# EAGLE design EnsembleFour (EAGLE 7.6.0)
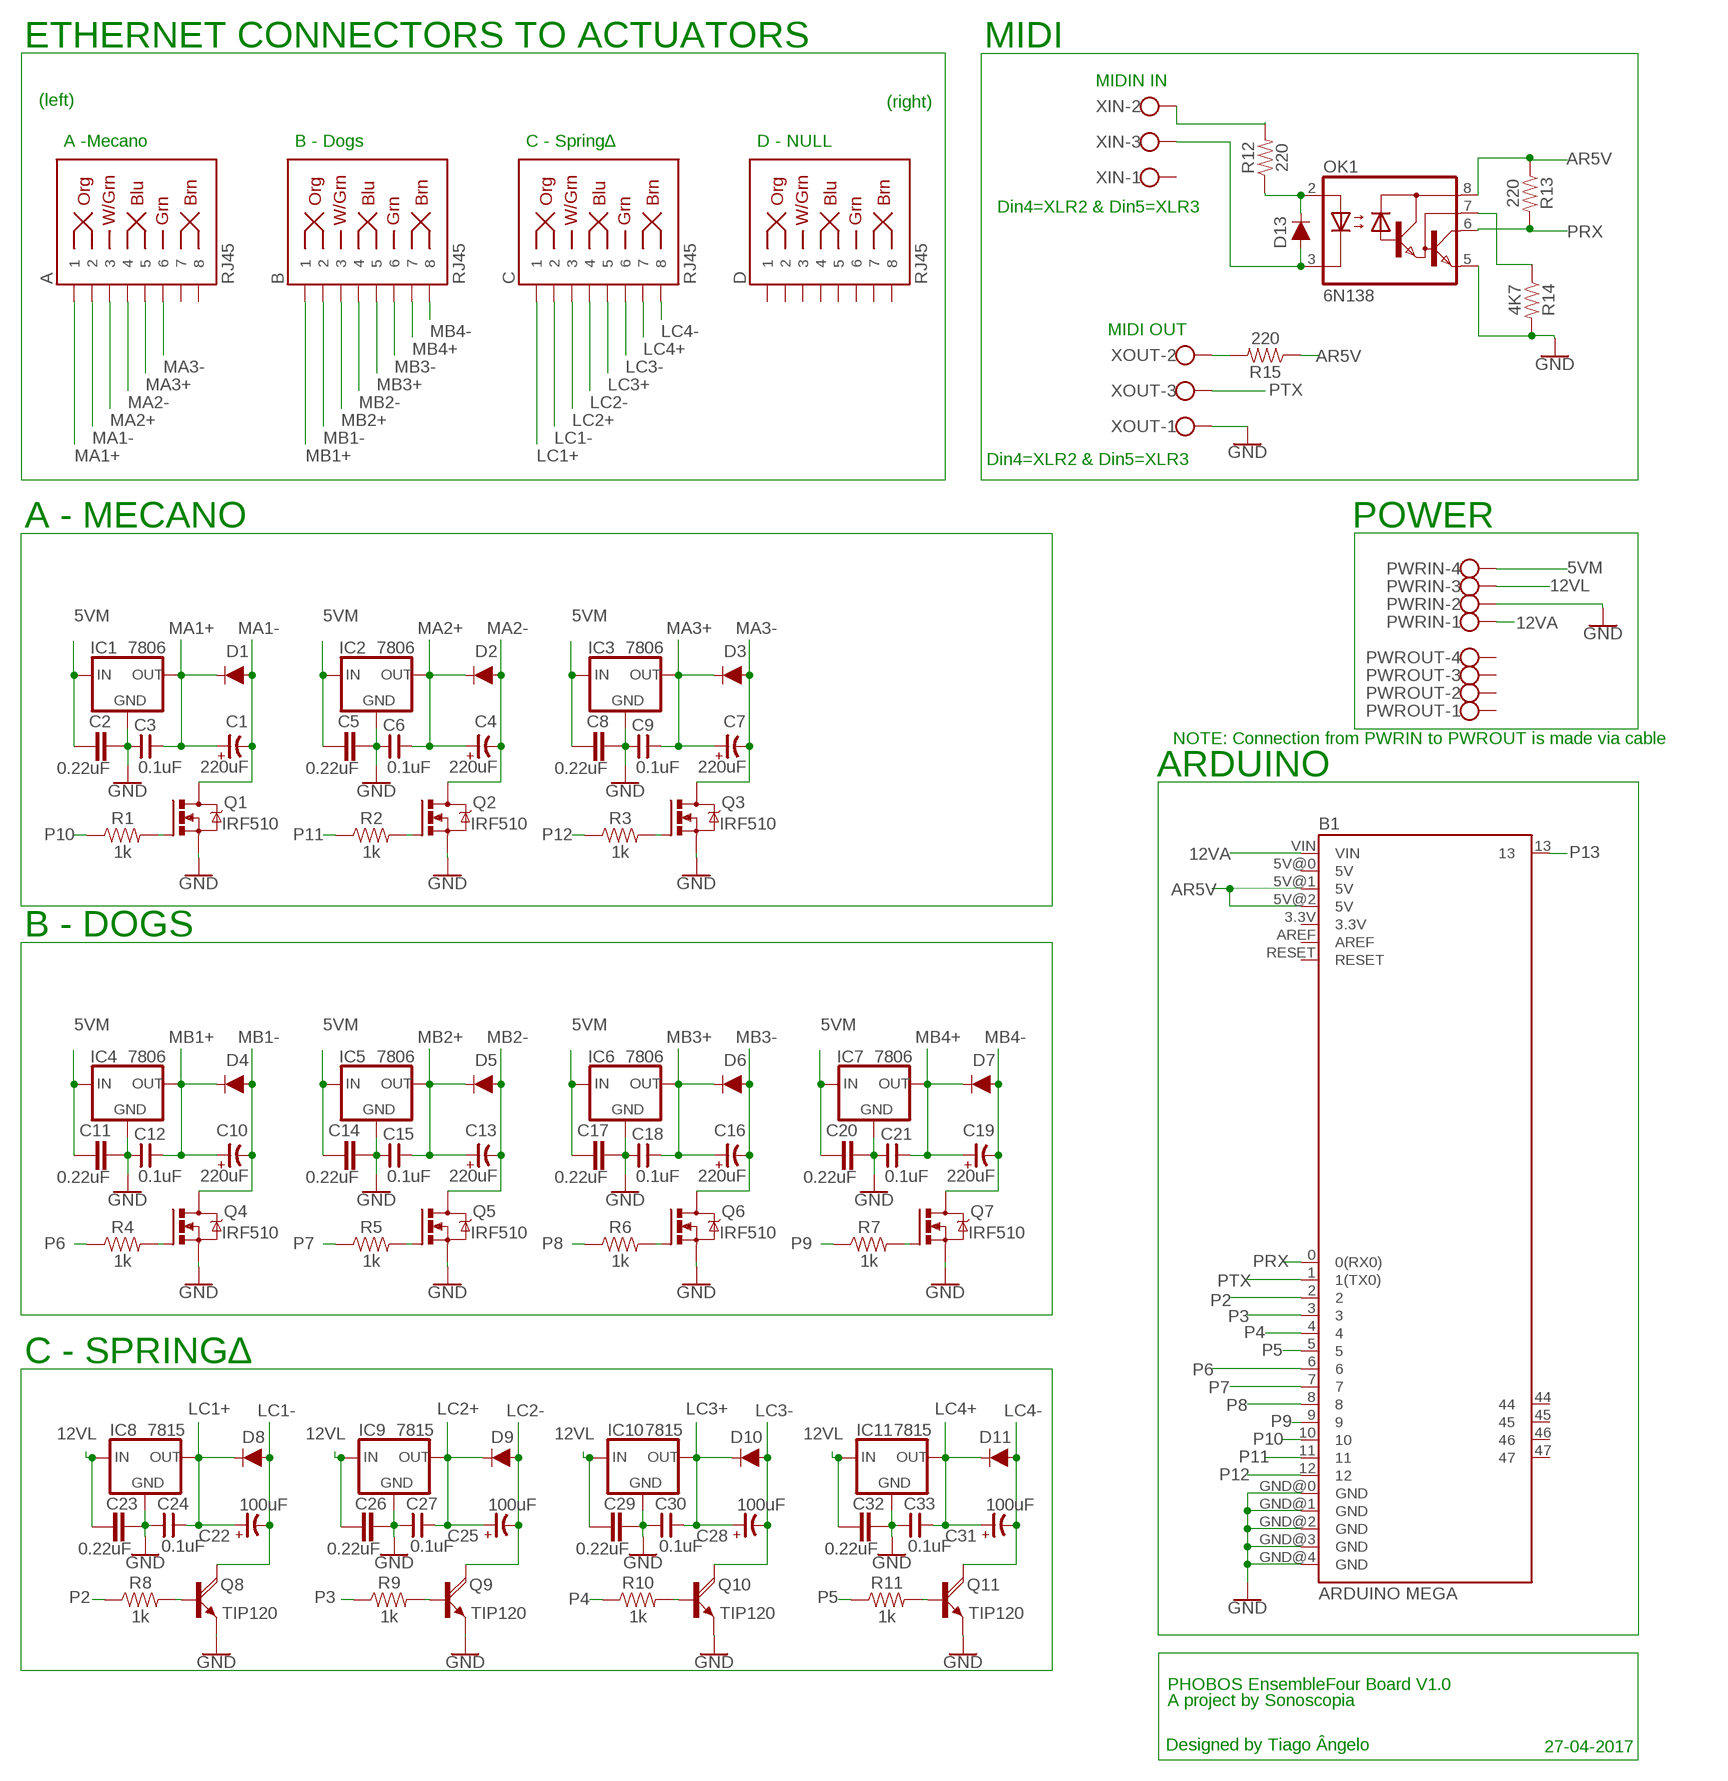
[diagram p0: schematic, sheet 1]

## Parts
A  RJ45  RJ45-8  [RJ45-8]
B  RJ45  RJ45-8  [RJ45-8]
B1  ARDUINO MEGA  ARDUINO_MEGA_R3FULL  [ARDUINO_MEGA]
C  RJ45  RJ45-8  [RJ45-8]
C1  220uF  CP-E-035X080  [E-035X080]
C2  0.22uF  C5/3  [C5B3]
C3  0.1uF  CNP-C025-050X025  [C025-050X025]
C4  220uF  CP-E-035X080  [E-035X080]
C5  0.22uF  C5/3  [C5B3]
C6  0.1uF  CNP-C025-050X025  [C025-050X025]
C7  220uF  CP-E-035X080  [E-035X080]
C8  0.22uF  C5/3  [C5B3]
C9  0.1uF  CNP-C025-050X025  [C025-050X025]
C10  220uF  CP-E-035X080  [E-035X080]
C11  0.22uF  C5/3  [C5B3]
C12  0.1uF  CNP-C025-050X025  [C025-050X025]
C13  220uF  CP-E-035X080  [E-035X080]
C14  0.22uF  C5/3  [C5B3]
C15  0.1uF  CNP-C025-050X025  [C025-050X025]
C16  220uF  CP-E-035X080  [E-035X080]
C17  0.22uF  C5/3  [C5B3]
C18  0.1uF  CNP-C025-050X025  [C025-050X025]
C19  220uF  CP-E-035X080  [E-035X080]
C20  0.22uF  C5/3  [C5B3]
C21  0.1uF  CNP-C025-050X025  [C025-050X025]
C22  100uF  CP-E-020X050  [E-020X050]
C23  0.22uF  C5/3  [C5B3]
C24  0.1uF  CNP-C025-050X025  [C025-050X025]
C25  100uF  CP-E-020X050  [E-020X050]
C26  0.22uF  C5/3  [C5B3]
C27  0.1uF  CNP-C025-050X025  [C025-050X025]
C28  100uF  CP-E-020X050  [E-020X050]
C29  0.22uF  C5/3  [C5B3]
C30  0.1uF  CNP-C025-050X025  [C025-050X025]
C31  100uF  CP-E-020X050  [E-020X050]
C32  0.22uF  C5/3  [C5B3]
C33  0.1uF  CNP-C025-050X025  [C025-050X025]
D  RJ45  RJ45-8  [RJ45-8]
D1  1A/50V/1.1V  DIODE-KIT2  [DIODE-1N4001-KIT]
D2  1A/50V/1.1V  DIODE-KIT2  [DIODE-1N4001-KIT]
D3  1A/50V/1.1V  DIODE-KIT2  [DIODE-1N4001-KIT]
D4  1A/50V/1.1V  DIODE-KIT2  [DIODE-1N4001-KIT]
D5  1A/50V/1.1V  DIODE-KIT2  [DIODE-1N4001-KIT]
D6  1A/50V/1.1V  DIODE-KIT2  [DIODE-1N4001-KIT]
D7  1A/50V/1.1V  DIODE-KIT2  [DIODE-1N4001-KIT]
D8  1A/50V/1.1V  DIODE-KIT2  [DIODE-1N4001-KIT]
D9  1A/50V/1.1V  DIODE-KIT2  [DIODE-1N4001-KIT]
D10  1A/50V/1.1V  DIODE-KIT2  [DIODE-1N4001-KIT]
D11  1A/50V/1.1V  DIODE-KIT2  [DIODE-1N4001-KIT]
D13  200mA/100V/1V  DIODE-1N4148  [DIODE-1N4148]
IC1  7806  78XXS  [78XXS]
IC2  7806  78XXS  [78XXS]
IC3  7806  78XXS  [78XXS]
IC4  7806  78XXS  [78XXS]
IC5  7806  78XXS  [78XXS]
IC6  7806  78XXS  [78XXS]
IC7  7806  78XXS  [78XXS]
IC8  7815  78XXS  [78XXS]
IC9  7815  78XXS  [78XXS]
IC10  7815  78XXS  [78XXS]
IC11  7815  78XXS  [78XXS]
OK1  6N138  [DIL08]
PWRIN  W237-4  [W237-4]
PWROUT  W237-4  [W237-4]
Q1  IRF510  IRF520  [TO220BV]
Q2  IRF510  IRF520  [TO220BV]
Q3  IRF510  IRF520  [TO220BV]
Q4  IRF510  IRF520  [TO220BV]
Q5  IRF510  IRF520  [TO220BV]
Q6  IRF510  IRF520  [TO220BV]
Q7  IRF510  IRF520  [TO220BV]
Q8  TIP120  TIP120V  [TO220AV]
Q9  TIP120  TIP120V  [TO220AV]
Q10  TIP120  TIP120V  [TO220AV]
Q11  TIP120  TIP120V  [TO220AV]
R1  1k  1KOHM-VERT-1/4W-1%  [AXIAL-0.1]
R2  1k  1KOHM-VERT-1/4W-1%  [AXIAL-0.1]
R3  1k  1KOHM-VERT-1/4W-1%  [AXIAL-0.1]
R4  1k  1KOHM-VERT-1/4W-1%  [AXIAL-0.1]
R5  1k  1KOHM-VERT-1/4W-1%  [AXIAL-0.1]
R6  1k  1KOHM-VERT-1/4W-1%  [AXIAL-0.1]
R7  1k  1KOHM-VERT-1/4W-1%  [AXIAL-0.1]
R8  1k  1KOHM-VERT-1/4W-1%  [AXIAL-0.1]
R9  1k  1KOHM-VERT-1/4W-1%  [AXIAL-0.1]
R10  1k  1KOHM-VERT-1/4W-1%  [AXIAL-0.1]
R11  1k  1KOHM-VERT-1/4W-1%  [AXIAL-0.1]
R12  220  1KOHM-HORIZ-1/4W-5%  [AXIAL-0.3]
R13  220  1KOHM-HORIZ-1/4W-5%  [AXIAL-0.3]
R14  4K7  1KOHM-HORIZ-1/4W-5%  [AXIAL-0.3]
R15  220  1KOHM-HORIZ-1/4W-5%  [AXIAL-0.3]
XIN  W237-103  [W237-103]
XOUT  W237-103  [W237-103]

## Nets
5VM [5VM]: C2.1 C5.1 C8.1 C11.1 C14.1 C17.1 C20.1 IC1.IN IC2.IN IC3.IN IC4.IN IC5.IN IC6.IN IC7.IN PWRIN.4
12VA [12VA]: B1.VIN PWRIN.1
12VL [12VL]: C23.1 C26.1 C29.1 C32.1 IC8.IN IC9.IN IC10.IN IC11.IN PWRIN.3
AR5V: B1.5V@1(5V) B1.5V@2(5V) OK1.8(VCC) R13.P$1 R15.P$1
GND [GND]: B1.GND@0(GND) B1.GND@1(GND) B1.GND@2(GND) B1.GND@3(GND) B1.GND@4(GND) C2.2 C3.1 C5.2 C6.1 C8.2 C9.1 C11.2 C12.1 C14.2 C15.1 C17.2 C18.1 C20.2 C21.1 C23.2 C24.1 C26.2 C27.1 C29.2 C30.1 C32.2 C33.1 IC1.GND IC2.GND IC3.GND IC4.GND IC5.GND IC6.GND IC7.GND IC8.GND IC9.GND IC10.GND IC11.GND OK1.5(GND) PWRIN.2 Q1.S Q2.S Q3.S Q4.S Q5.S Q6.S Q7.S Q8.E Q9.E Q10.E Q11.E R14.P$2 XOUT.1
LC1+: C22.+ C24.2 C.1 D8.C IC8.OUT
LC1-: C22.- C.2 D8.A Q8.C
LC2+: C25.+ C27.2 C.3 D9.C IC9.OUT
LC2-: C25.- C.4 D9.A Q9.C
LC3+: C28.+ C30.2 C.5 D10.C IC10.OUT
LC3-: C28.- C.6 D10.A Q10.C
LC4+: C31.+ C33.2 C.7 D11.C IC11.OUT
LC4-: C31.- C.8 D11.A Q11.C
MA1+: A.1 C1.+ C3.2 D1.C IC1.OUT
MA1-: A.2 C1.- D1.A Q1.D
MA2+: A.3 C4.+ C6.2 D2.C IC2.OUT
MA2-: A.4 C4.- D2.A Q2.D
MA3+: A.5 C7.+ C9.2 D3.C IC3.OUT
MA3-: A.6 C7.- D3.A Q3.D
MB1+: B.1 C10.+ C12.2 D4.C IC4.OUT
MB1-: B.2 C10.- D4.A Q4.D
MB2+: B.3 C13.+ C15.2 D5.C IC5.OUT
MB2-: B.4 C13.- D5.A Q5.D
MB3+: B.5 C16.+ C18.2 D6.C IC6.OUT
MB3-: B.6 C16.- D6.A Q6.D
MB4+: B.7 C19.+ C21.2 D7.C IC7.OUT
MB4-: B.8 C19.- D7.A Q7.D
N$1: Q1.G R1.P$2
N$2: R15.P$2 XOUT.2
N$3: Q2.G R2.P$2
N$4: Q9.B R9.P$2
N$5: Q10.B R10.P$2
N$9: Q8.B R8.P$2
N$14: Q3.G R3.P$2
N$16: Q4.G R4.P$2
N$18: Q5.G R5.P$2
N$19: Q6.G R6.P$2
N$20: Q7.G R7.P$2
N$21: Q11.B R11.P$2
N$25: D13.A OK1.3(C) XIN.3
N$26: D13.C OK1.2(A) R12.P$1
N$27: R12.P$2 XIN.2
N$29: OK1.7(VB) R14.P$1
P2: B1.2 R8.P$1
P3: B1.3 R9.P$1
P4: B1.4 R10.P$1
P5: B1.5 R11.P$1
P6: B1.6 R4.P$1
P7: B1.7 R5.P$1
P8: B1.8 R6.P$1
P9: B1.9 R7.P$1
P10: B1.10 R1.P$1
P11: B1.11 R2.P$1
P12: B1.12 R3.P$1
P13: B1.13
PRX: B1.0(0(RX0)) OK1.6(VO) R13.P$2
PTX: B1.1(1(TX0)) XOUT.3
Unconnected: A.7 A.8 B1.3.3V B1.5V@0(5V) B1.44 B1.45 B1.46 B1.47 B1.AREF B1.RESET D.1 D.2 D.3 D.4 D.5 D.6 D.7 D.8 PWROUT.1 PWROUT.2 PWROUT.3 PWROUT.4 XIN.1

## Notes on the sheet
- ETHERNET CONNECTORS TO ACTUATORS | MIDI
- MIDIN IN
- (left) | (right)
- A -Mecano | B - Dogs | C - Spring∆ | D - NULL
- Din4=XLR2 & Din5=XLR3
- MIDI OUT
- Din4=XLR2 & Din5=XLR3
- A - MECANO | POWER
- NOTE: Connection from PWRIN to PWROUT is made via cable
- ARDUINO
- B - DOGS
- C - SPRING∆
- PHOBOS EnsembleFour Board V1.0
- A project by Sonoscopia
- Designed by Tiago Ângelo | 27-04-2017

## Library data of the parts
A B C D = SparkFun-Connectors:RJ45-8: RJ45 Jack - 8 pin Simple RJ45, 8-pin connection. Commonly used for Cat5, Cat5e, and Cat6 Ethernet cables. Here is the connector we sell at SparkFun: RJ45 8-Pin Connector <https://www.sparkfun.com/products/643> (PRT-00643) Datasheet <https://cdn.sparkfun.com/datasheets/Prototyping/04908.pdf> It is used on this SparkFun product: SparkFun RJ45 Breakout <https://www.sparkfun.com/products/716> (BOB-00716) Note, you may also be interested in the "MAGJACK" version of this. It is basically a RJ45 connector, but also has some status LEDs built into the connector housing. You can check that out in this library at the device named "MAGJACK.dev" and see these products online: RJ45 Ethernet MagJack-Compatible <https://www.sparkfun.com/products/8534> (PRT-08534) SparkFun RJ45 MagJack Breakout <https://www.sparkfun.com/products/13021> (BOB-13021); PROD_ID: CONN-08506; SF_ID: PRT-00643
B1 = PHOBOS-Boards:ARDUINO_MEGA_R3: Arduino Mega R3 ATmega2560 R3 compatible footprint. SparkFun Products: Arduino Mega 2560 R3 <https://www.sparkfun.com/products/11061>
C1 C4 C7 C10 C13 C16 C19 C22 C25 C28 C31 = cap-master:CP-: POLARIZED CAP
C2 C5 C8 C11 C14 C17 C20 C23 C26 C29 C32 = capacitor-wima:C: CAPACITOR naming: grid - package width
C3 C6 C9 C12 C15 C18 C21 C24 C27 C30 C33 = cap-master:CNP-: NON-POLARIZED CAP
D1-D11 = SparkFun-DiscreteSemi:DIODE: Diode These are standard reverse protection diodes and small signal diodes. SparkFun Products: SparkFun SparkPunk Sound Kit <https://www.sparkfun.com/products/11177> SparkFun ESP8266 Thing <https://www.sparkfun.com/products/13231>; PROD_ID: DIO-09176
D13 = SparkFun-DiscreteSemi:DIODE: Diode These are standard reverse protection diodes and small signal diodes. SparkFun Products: SparkFun SparkPunk Sound Kit <https://www.sparkfun.com/products/11177> SparkFun ESP8266 Thing <https://www.sparkfun.com/products/13231>; PROD_ID: DIO-08378
IC1-IC11 = v-reg:78XXS: VOLTAGE REGULATOR
OK1 = optocoupler:6N138: MOTOROLA OPTO COUPLER; MF: VISHAY/TELEFUNKEN; MPN: 6N138; OC_FARNELL: 9860150; OC_NEWARK: 35K5294
PWRIN PWROUT = con-wago-500:W237-4: WAGO SCREW CLAMP; OC_FARNELL: unknown; OC_NEWARK: unknown
Q1-Q7 = transistor-power:IRF520: HEXFET Power MOSFET
Q8-Q11 = rocketfarm:TIP120: NPN DARLINGTON TRANSISTOR
R1-R11 = SparkFun-Resistors:1KOHM: 1kΩ resistor A resistor is a passive two-terminal electrical component that implements electrical resistance as a circuit element. Resistors act to reduce current flow, and, at the same time, act to lower voltage levels within circuits. - Wikipedia; PROD_ID: RES-12182
R12-R15 = SparkFun-Resistors:1KOHM: 1kΩ resistor A resistor is a passive two-terminal electrical component that implements electrical resistance as a circuit element. Resistors act to reduce current flow, and, at the same time, act to lower voltage levels within circuits. - Wikipedia; PROD_ID: RES-08380; VALUE: 1k
XIN XOUT = con-wago-500:W237-103: WAGO SCREW CLAMP; MPN: 237-103; OC_FARNELL: unknown; OC_NEWARK: 18M7116

## Net classes
0 default: width 0.508 mm, drill 0.508 mm, clearance 0.406 mm
1 GND: width 1.016 mm, drill 0.508 mm, clearance 0.508 mm
2 5VM: width 1.016 mm, drill 0.508 mm, clearance 0.508 mm
3 12VL: width 0.61 mm, drill 0.508 mm, clearance 0.508 mm
4 12VA: width 0.508 mm, drill 0.508 mm, clearance 0.508 mm

## Board
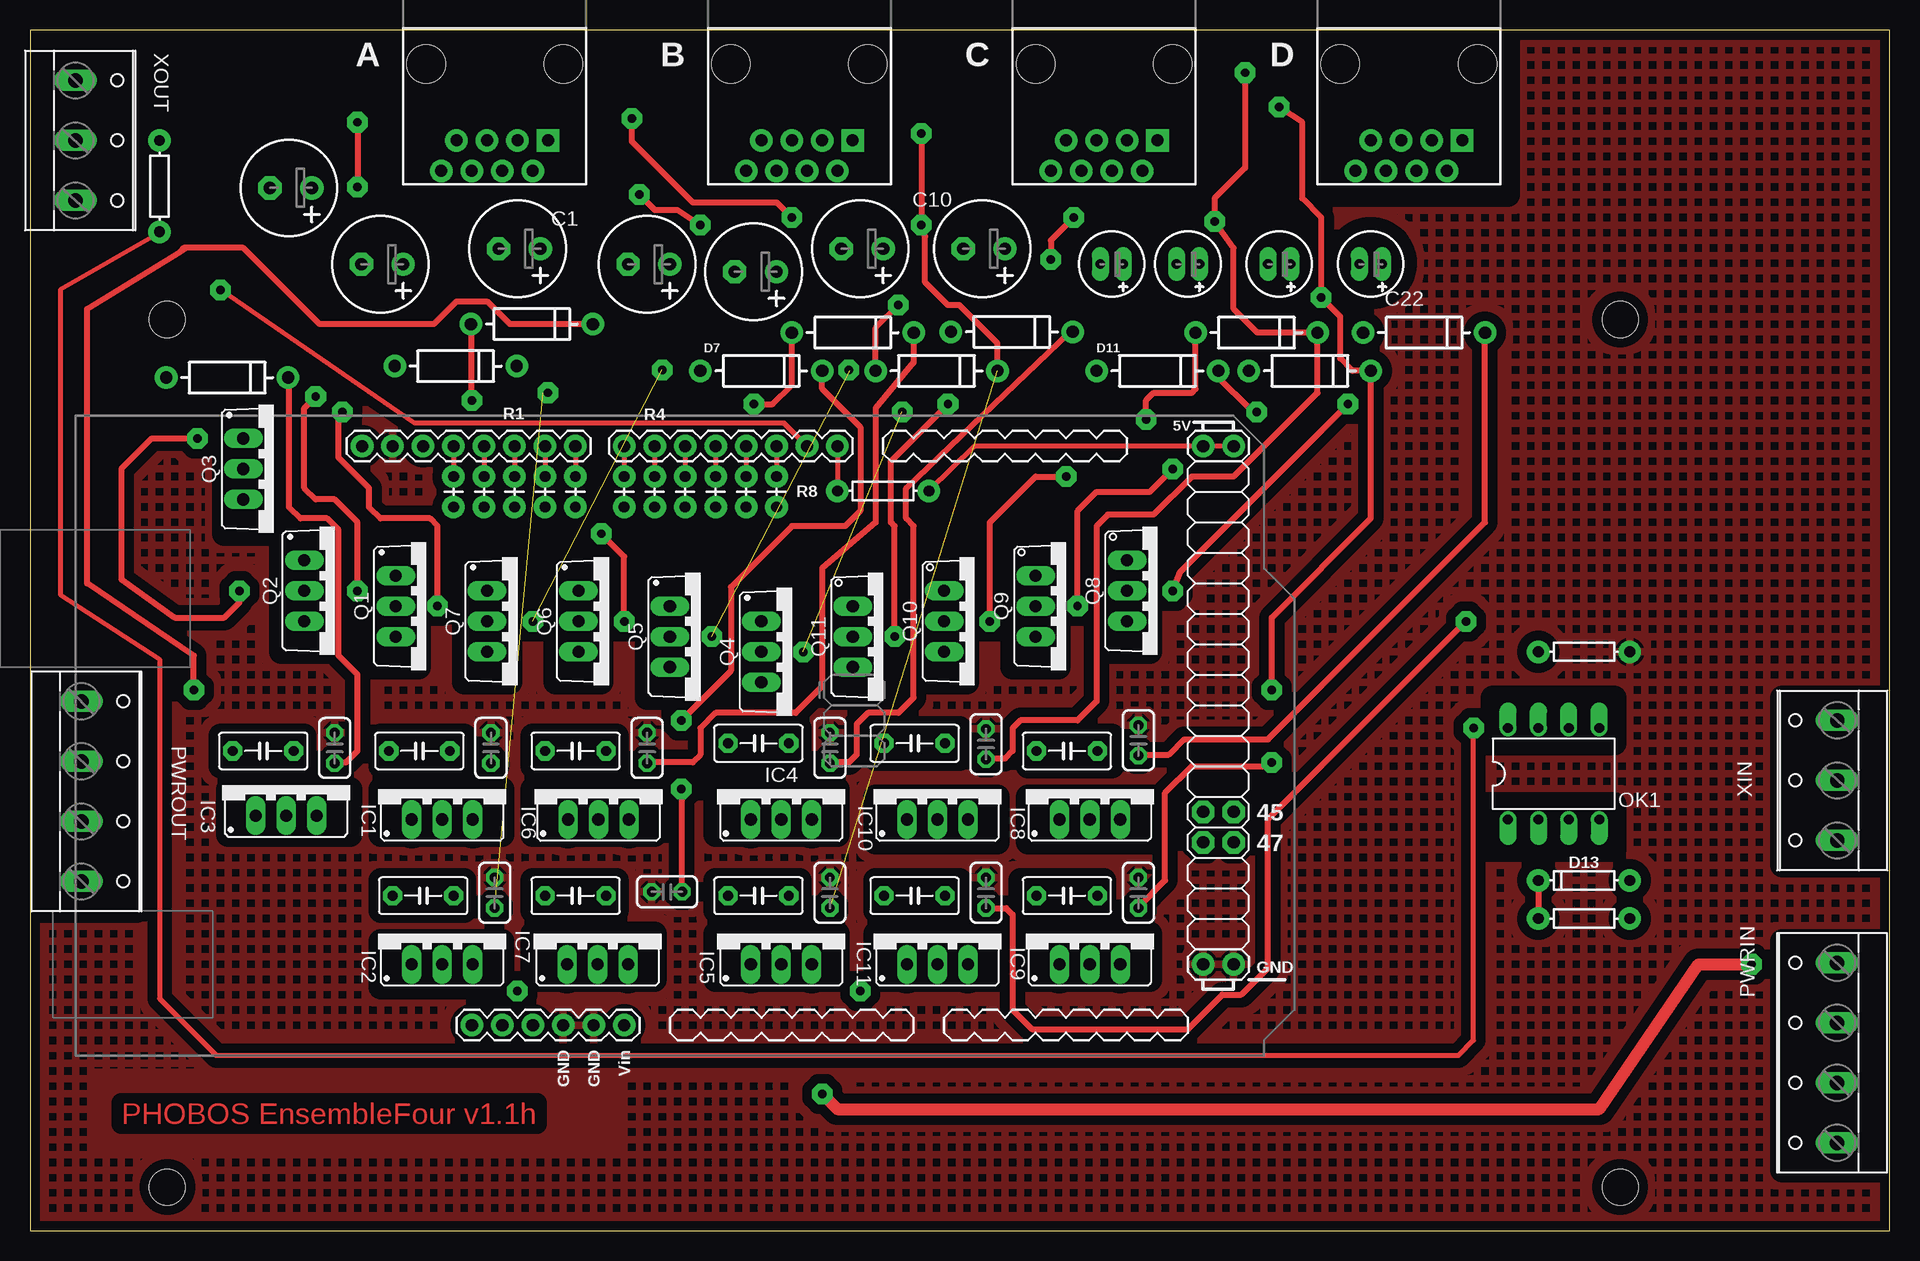
[diagram p1: board, top side]
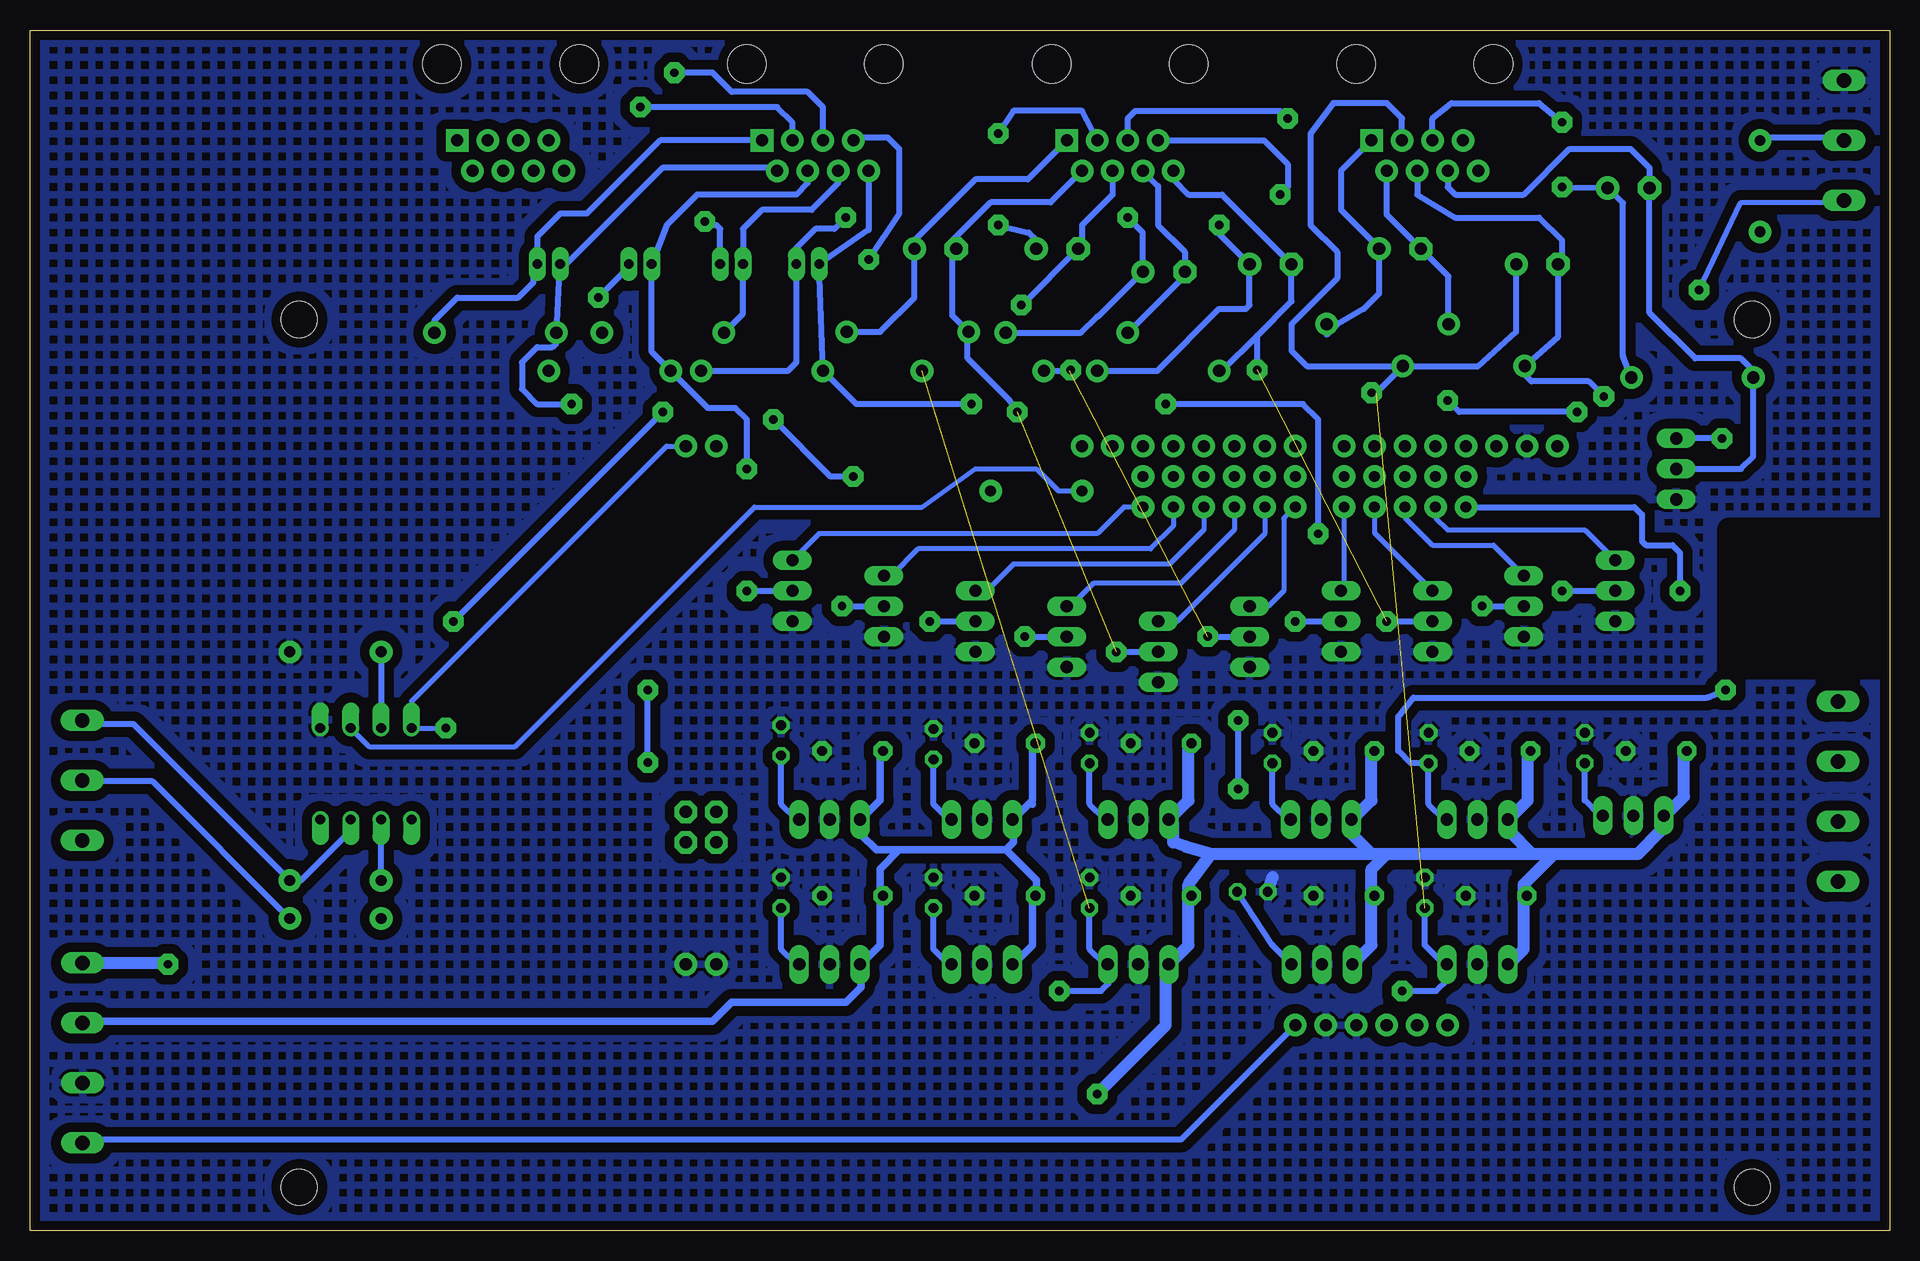
[diagram p2: board, bottom side, seen from below]

Size 155 x 100.08 mm. Coordinates in mm from the lower left corner, seen from the top.
Outline: 0,0 155,0 155,100.08 0,100.08 0,0
Copper layers (1*16): Top 0.035mm / dielectric 1.5mm / Bottom 0.035mm
Design rules "Dek": minimum track width 12mil, minimum drill 36mil, track to track 12mil, track to pad 12mil, pad to pad 12mil, via to via 12mil, smd to smd 0mil, copper to edge 10mil, drill to drill 12mil, minimum pad ring 12mil, minimum via ring 20mil, stop-mask expansion 4mil, vias tented up to drill 25mil, thermal gap 10mil
Holes 3 mm at 132.55,75.95 132.55,3.65 11.45,3.65 11.45,75.95
tRestrict: area 55.9,86.4 to 72.4,108; area 81.3,86.4 to 97.8,108; area 106.7,86.4 to 123.2,108; area 121.9,40.6 to 132.1,44.5; area 121.9,31.8 to 132.1,35.6; area 146.1,30.5 to 154.9,44.5; area 146.1,5.1 to 154.9,24.1; area 0,83.8 to 8.9,97.8; area 0,26.7 to 8.9,47; area 16.2,58.1 to 20,68.3; area 21,48.3 to 24.8,58.4; area 28.6,47 to 32.4,57.1; 42 more areas
bRestrict: area -2.5,47 to 13.3,58.4
vRestrict: area 71.1,64.1 to 91.4,66.7; area 96.5,36.2 to 101.6,64.1; area 96.5,23.5 to 101.6,31.1; area 53.3,15.9 to 73.7,18.4; area 76.2,15.9 to 96.5,18.4; area -2.5,47 to 13.3,58.4; area 10.2,84.5 to 11.4,89.5; area 13.3,69.8 to 19.7,72.4; area 32.4,70.8 to 38.7,73.3; area 38.7,74.3 to 45.1,76.8; area 57.8,70.5 to 64.1,73; area 65.4,73.7 to 71.8,76.2; 7 more areas

### Footprints (pad centres in the part's own frame; a part is rotated, then mirrored left to right if it is on the bottom)
RJ45-8 = drill 1 pad 1.88 square: 1 -4.445,6.35 | drill 1 pad 1.88: 2 -3.175,8.89; 3 -1.905,6.35; 4 -0.635,8.89; 5 0.635,6.35; 6 1.905,8.89; 7 3.175,6.35; 8 4.445,8.89 | hole 3.2: -5.715,0; 5.715,0
ARDUINO_MEGA = drill 1.016 pad 1.88: 0 13.97,24.13; 1 11.43,24.13; 2 8.89,24.13; 3 6.35,24.13; 3.3V -13.97,-24.13; 4 3.81,24.13; 5 1.27,24.13; 5V@0 -11.43,-24.13; 5V@1 44.45,24.13; 5V@2 46.99,24.13; 6 -1.27,24.13; 7 -3.81,24.13; 8 -7.874,24.13; 9 -10.414,24.13; 10 -12.954,24.13; 11 -15.494,24.13; 12 -18.034,24.13; 13 -20.574,24.13; AREF -25.654,24.13; GND@0 -8.89,-24.13; GND@1 -6.35,-24.13; GND@2 44.45,-19.05; GND@3 46.99,-19.05; GND@4 -23.114,24.13; RESET -16.51,-24.13; VIN -3.81,-24.13 | drill 1.016 pad 1.88 octagon: 44 44.45,-6.35; 45 46.99,-6.35; 46 44.45,-8.89; 47 46.99,-8.89
E-035X080 = drill 1.016 pad 1.93: + -1.905,0 | drill 1.016 pad 1.93 octagon: - 1.587,0
C5B3 = drill 0.813 pad 1.6 octagon: 1 -2.54,0; 2 2.54,0
C025-050X025 = drill 0.813 pad 1.422 octagon: 1 -1.27,0; 2 1.27,0
E-020X050 = drill 0.813 long: + -0.953,0; - 0.953,0
DIODE-1N4001-KIT = drill 1.016 pad 1.88: A -5.08,0; C 5.08,0
DIODE-1N4148 = drill 0.9 pad 1.88: A -3.81,0; C 3.81,0
78XXS = drill 1.016 long: GND 0,-2.54; IN -2.54,-2.54; OUT 2.54,-2.54
DIL08 = drill 0.813 offset: 1 -3.81,-3.81; 2 -1.27,-3.81; 3 1.27,-3.81; 4 3.81,-3.81; 5 3.81,3.81; 6 1.27,3.81; 7 -1.27,3.81; 8 -3.81,3.81
W237-4 = drill 1.194 long: 1 -7.5,-1.27; 2 -2.5,-1.27; 3 2.5,-1.27; 4 7.5,-1.27
TO220BV = drill 1.016 long: D 0,-2.54; G -2.54,-2.54; S 2.54,-2.54
TO220AV = drill 1.016 long: B -2.54,-2.54; C 0,-2.54; E 2.54,-2.54
AXIAL-0.1 = drill 0.9 pad 1.88: P$1 -1.27,0; P$2 1.27,0
AXIAL-0.3 = drill 0.9 pad 1.88: P$1 -3.81,0; P$2 3.81,0
W237-103 = drill 1.194 long: 1 -5,-1.29; 2 0,-1.29; 3 5,-1.29

### Placement (x,y rotation side)
A  38.73,97.23 180 top
B  64.13,97.23 180 top
B1  53.34,41.27 0 top
C  89.53,97.23 180 top
C1  40.64,81.84 180 top
C2  32.46,40.01 0 top
C3  38.42,40.25 270 top
C4  29.21,80.57 180 top
C5  32.78,27.94 0 top
C6  38.73,28.18 270 top
C7  21.59,86.92 180 top
C8  19.44,40.01 0 top
C9  25.4,40.25 270 top
C10  79.38,81.84 180 top
C11  60.72,40.64 0 top
C12  66.68,40.25 270 top
C13  69.22,81.84 180 top
C14  60.72,27.94 0 top
C15  66.68,28.18 270 top
C16  60.32,79.94 180 top
C17  45.48,40.01 0 top
C18  51.43,40.25 270 top
C19  51.43,80.57 180 top
C20  45.48,27.94 0 top
C21  53.1,28.26 0 top
C22  111.76,80.57 180 top
C23  86.44,40.01 0 top
C24  92.39,40.88 270 top
C25  104.14,80.57 180 top
C26  86.44,27.94 0 top
C27  92.39,28.18 270 top
C28  96.52,80.57 180 top
C29  73.74,40.64 0 top
C30  79.69,40.56 270 top
C31  90.17,80.57 180 top
C32  73.74,27.94 0 top
C33  79.69,28.18 270 top
D  114.94,97.23 180 top
D1  41.84,75.56 0 top
D2  35.48,72.07 0 top
D3  16.44,71.12 0 top
D4  81.84,74.93 0 top
D5  75.56,71.68 0 top
D6  68.58,74.86 0 top
D7  60.96,71.68 0 top
D8  116.21,74.86 0 top
D9  106.68,71.68 0 top
D10  102.24,74.86 0 top
D11  93.98,71.68 0 top
D13  129.54,29.21 180 top
IC1  34.37,36.83 0 top
IC2  34.37,24.77 0 top
IC3  21.35,37.15 0 top
IC4  62.62,36.83 0 top
IC5  62.62,24.77 0 top
IC6  47.38,36.83 0 top
IC7  47.31,24.77 0 top
IC8  88.34,36.83 0 top
IC9  88.34,24.77 0 top
IC10  75.64,36.83 0 top
IC11  75.64,24.77 0 top
OK1  127,38.1 0 top
PWRIN  149.35,14.84 90 top
PWROUT  5.57,36.63 270 top
Q1  33.02,52.07 270 top
Q2  25.4,53.34 270 top
Q3  20.32,63.5 270 top
Q4  63.5,48.26 270 top
Q5  55.88,49.53 270 top
Q6  48.26,50.8 270 top
Q7  40.64,50.8 270 top
Q8  93.98,53.34 270 top
Q9  86.36,52.07 270 top
Q10  78.74,50.8 270 top
Q11  71.12,49.53 270 top
R1  40.39,61.59 270 top
R2  37.85,61.59 270 top
R3  35.31,61.59 270 top
R4  52.07,61.59 270 top
R5  49.53,61.59 270 top
R6  45.47,61.59 270 top
R7  42.93,61.59 270 top
R8  62.23,61.59 270 top
R9  59.69,61.59 270 top
R10  57.15,61.59 270 top
R11  54.61,61.59 270 top
R12  129.54,26.04 0 top
R13  71.12,61.67 180 top
R14  129.54,48.26 0 top
R15  10.79,87.07 90 top
XIN  149.35,37.54 90 top
XOUT  5.08,90.88 270 top

### Tracks (layer width: path | path; a pad name or v marks a point on that pad's centre or on a via)
5VM  (via drill 0.7)
  Top 1.016: v66.04,11.43 67.31,10.16 130.81,10.16 139.06,22.23 v143.51,22.23
  Bottom 1.016: 43.18,27.94 43.18,23.81 IC7.IN | 43.18,27.94 C20.1 | 44.77,34.29 43.18,35.88 43.18,40.01 C17.1 | 44.77,34.29 IC6.IN | C8.1 17.15,40.01 17.15,36.2 18.73,34.61 IC3.IN 19.05,34.29 19.05,33.34 20.95,31.43 27.94,31.43 | 30.48,27.94 30.48,23.5 31.75,22.23 IC2.IN | 30.48,27.94 C5.1 | 31.75,34.29 30.16,35.88 30.16,40.01 C2.1 | C11.1 58.42,40.64 58.42,35.88 60.01,34.29 IC4.IN | 58.42,27.94 58.42,23.81 60.01,22.23 IC5.IN 60.32,21.91 60.32,17.14 v66.04,11.43 | 58.42,27.94 C14.1 | 59.69,33.97 IC4.IN | 56.51,31.43 58.74,32.07 59.69,32.38 59.69,33.9 IC4.IN | 56.51,31.43 43.18,31.43 | 43.18,31.43 41.91,31.43 | 41.91,31.43 29.84,31.43 | 29.84,31.43 27.94,31.43 | PWRIN.4 143.51,22.34 v143.51,22.23 | 58.42,27.94 58.42,28.89 56.51,31.43 | 43.18,27.94 43.18,30.16 41.91,31.43 | 30.48,27.94 30.48,28.89 27.94,31.43 | 31.75,34.29 31.75,33.34 29.84,31.43 | 44.77,34.29 44.77,33.02 43.18,31.43 | 31.75,34.29 IC1.IN
12VA
  Bottom 0.508: B1.VIN 59.05,7.62 150.5,7.62 PWRIN.1
12VL
  Bottom 0.61: IC11.IN 73.03,22.23 71.44,23.81 71.44,27.94 C32.1 71.12,28.02 71.12,29.21 73.66,31.75 | 71.6,35.72 73.03,34.29 IC10.IN 73.03,34.22 73.03,32.38 73.66,31.75 | 71.6,35.72 71.44,35.88 71.44,40.64 C29.1 | 71.44,35.56 71.6,35.72 | C23.1 84.14,40.01 84.14,35.88 85.72,34.29 IC8.IN | 84.14,27.94 84.14,23.81 85.72,22.23 IC9.IN 86.04,22.23 86.04,21.59 | 86.04,21.59 86.04,21.27 | PWRIN.3 150.5,17.46 98.11,17.46 96.52,19.05 87,19.05 85.72,20.32 85.72,21.27 86.04,21.59 | 85.41,34.29 IC8.IN | 84.14,27.94 C26.1 | 82.55,31.75 84.46,31.75 85.72,33.02 85.72,34.22 IC8.IN | 82.55,31.75 73.66,31.75 | 84.14,27.94 84.14,30.16 82.55,31.75
AR5V  (via drill 0.7)
  Top 0.406: R15.P$1 10.79,83.19 2.54,78.42 2.54,53.02 10.79,47.62 10.79,19.37 15.56,14.61 119.06,14.61 120.33,15.88 v120.33,41.91 | B1.5V@2 B1.5V@1 78.74,65.41 R13.P$1
  Bottom 0.406: v120.33,41.91 OK1.8 123.19,44.13 101.92,65.41 B1.5V@2
GND
  Bottom 1.016: C21.1 51.43,29.49 51.43,29.45
  pour Bottom (isolate 0.813, hatched): -5.08,104.14 160.02,104.14 160.02,0 -5.08,0
  pour Top (isolate 0.813, hatched): 0,100.33 154.94,100.33 154.94,0 0,0
LC1+
  Top 0.508: C24.2 92.39,39.69 94.93,39.69 96.2,40.96 103.19,40.96 121.28,59.05 D8.C
  Bottom 0.508: C24.2 92.39,35.56 91.12,34.29 IC8.OUT | C.1 102.48,90.88 108.59,84.77 110.81,84.77 112.71,82.87 C22.+ | C22.+ 112.71,80.33 113.03,80.01 | 113.03,80.01 113.03,80.25 C22.+ | D8.C 121.28,75.88 119.38,77.79 114.3,77.79 113.03,79.06 113.03,80.01
LC1-  (via drill 0.7)
  Top 0.508: v95.25,53.34 95.88,54.93 v109.86,68.9
  Bottom 0.508: C.2 92.95,88.58 102.28,88.58 110.84,80.03 | 110.84,80.03 D8.A 111.12,73.98 111.44,73.66 112.71,73.66 113.98,72.39 113.98,70.17 112.71,68.9 v109.86,68.9 | 110.84,80.03 C22.- 110.49,80.89 110.49,81.28 | v95.25,53.34 Q8.C
LC2+  (via drill 0.7)
  Top 0.508: C27.2 92.39,26.99 94.62,29.21 94.62,36.51 96.84,38.73 103.19,38.73 v103.5,39.05 | v104.14,93.66 106.04,92.39 106.04,86.04 107.63,84.45 v107.63,77.79 109.22,76.2 109.22,72.71 110.25,71.68 D9.C 111.76,59.37 103.5,51.12 v103.5,45.09
  Bottom 0.508: C27.2 92.39,23.5 91.12,22.23 IC9.OUT | C.3 91.44,92.39 92.71,93.66 v104.14,93.66 | C25.+ 105.09,80.33 v107.63,77.79 | v103.5,39.05 v103.5,45.09
LC2-  (via drill 0.7)
  Top 0.508: v87.31,52.07 87.31,60.01 88.9,61.59 93.34,61.59 v95.25,63.5
  Bottom 0.508: C.4 90.17,87.31 91.12,86.36 99.38,86.36 101.92,83.82 C25.- 103.19,73.27 D9.A 98.5,68.58 96.2,68.58 95.25,67.63 v95.25,63.5 | v87.31,52.07 Q9.C
LC3+  (via drill 0.7)
  Top 0.508: v101.28,96.52 101.28,88.58 98.74,86.04 v98.74,84.14 100.33,81.92 100.33,76.83 102.31,74.86 D10.C 107.31,69.85 100.33,62.87 96.84,62.87 93.66,59.69 89.85,59.69 88.9,58.74 88.9,44.13 87.31,42.55 82.55,42.55 81.91,41.91 81.91,40.01 81.28,39.37 79.77,39.37 C30.2 79.69,39.37
  Bottom 0.508: C30.2 79.69,35.56 78.42,34.29 IC10.OUT | C.5 88.9,93.66 90.17,94.93 96.52,94.93 98.11,96.52 v101.28,96.52 | C28.+ 97.47,83.5 97.79,83.82 98.43,83.82 v98.74,84.14
LC3-  (via drill 0.7)
  Top 0.508: v80.01,50.8 80.01,59.05 83.82,62.87 v86.36,62.87 | v93.03,67.63 93.03,69.22 93.66,69.85 96.84,69.85 97.16,70.17 D10.A
  Bottom 0.508: C.6 87.63,87.31 89.85,85.09 93.98,85.09 95.57,83.5 C28.- 95.57,76.44 D10.A | v80.01,50.8 Q10.C | v86.36,62.87 88.26,62.87 v93.03,67.63
LC4+  (via drill 0.7)
  Top 0.508: C33.2 81.35,26.91 81.91,26.35 81.91,18.41 83.5,16.83 96.52,16.83 99.38,19.68 100.97,19.68 103.19,21.91 103.19,34.29 v119.7,50.8 | v102.24,68.26 102.24,68.5 101.68,68.5 99.06,71.12 D11.C | v87,84.45 85.09,82.55 v85.09,80.96
  Bottom 0.508: C33.2 79.69,23.5 78.42,22.23 IC11.OUT | v87,84.45 87.95,83.5 89.53,83.5 91.12,81.92 C31.+ 91.12,72.39 91.83,71.68 D11.C | v119.7,50.8 v102.24,68.26 | C.7 86.12,91.12 83.5,91.12 82.55,90.17 82.55,84.77 v85.09,80.96
LC4-  (via drill 0.7)
  Top 0.508: v76.52,68.9 71.75,64.14 71.75,59.05 72.07,58.74 v72.07,49.53
  Bottom 0.508: C.8 85.09,83.43 C31.- D11.A 86.12,68.9 v76.52,68.9 | v72.07,49.53 Q11.C
MA1+  (via drill 0.7)
  Top 0.508: D1.C 40.01,75.56 38.1,77.47 35.56,77.47 33.66,75.56 24.13,75.56 17.78,81.92 12.82,81.92 12.5,81.6 | v13.65,45.09 13.65,47.94 4.76,53.98 4.76,76.83 12.5,81.6 | 12.5,81.6 13.02,81.92
  Bottom 0.508: IC1.OUT 37.15,34.29 38.42,35.56 C3.2 39.93,38.98 40.96,40.01 40.96,42.86 39.69,44.45 15.24,44.45 v13.65,45.09 | A.1 45.72,88.34 45.72,85.09 42.55,81.92 C1.+ 42.55,78.11 43.82,76.83 46.04,75.56 46.91,74.69 D1.C
MA1-  (via drill 0.7)
  Top 0.508: v33.97,52.07 33.97,58.74 33.34,59.37 29.21,59.37 28.26,60.33 28.26,61.91 25.72,64.45 25.72,67.94 v26.03,68.26 | v36.83,69.22 36.83,75.49 D1.A
  Bottom 0.508: A.2 41.91,84.7 C1.- 36.76,79.54 D1.A | v33.97,52.07 Q1.D | v26.03,68.26 35.88,68.26 v36.83,69.22
MA2+  (via drill 0.7)  (1 unrouted)
  Bottom 0.508: C6.2 38.73,23.81 37.15,22.23 IC2.OUT 36.83,22.15 36.83,20.95 37.78,20 v40.64,20 | D2.C 34.29,72.07 31.12,74.93 C4.+ | A.3 40.64,92.71 41.91,93.98 46.35,93.98 48.26,91.44 48.26,83.82 46.04,81.6 46.04,79.38 49.85,75.56 49.85,73.34 48.58,72.07 D2.C | v43.18,69.85 42.79,69.85 D2.C
MA2-  (via drill 0.7)
  Top 0.508: v27.3,53.34 27.3,59.05 25.4,60.96 23.81,60.96 22.86,61.91 22.86,68.58 v23.81,69.53
  Bottom 0.508: A.4 39.37,86.36 36.2,84.45 29.21,84.45 27.3,82.55 27.3,80.89 C4.- 27.62,74.54 D2.A 30.48,72 30.48,71.44 29.84,70.8 25.08,70.8 v23.81,69.53 | v27.3,53.34 Q2.D
MA3+  (via drill 0.7)
  Top 0.508: v27.3,92.39 v27.3,87 | C9.2 25.4,39.05 26.35,39.05 27.3,40.01 27.3,46.35 25.72,47.94 25.72,58.42 24.77,59.37 22.54,59.37 21.59,60.33 21.59,71.05 D3.C
  Bottom 0.508: C9.2 25.4,35.88 24.13,34.61 IC3.OUT | A.5 38.1,92.71 36.51,93.98 29.21,93.98 v27.3,92.39 | v27.3,87 C7.+ 22.23,85.65 22.23,72.95 D3.C
MA3-
  Bottom 0.508: A.6 36.83,87 36.2,86.36 30.48,86.36 26.67,90.17 21.59,90.17 20,88.58 C7.- 20,76.52 16.19,72.71 12.38,72.71 11.36,71.68 D3.A 11.36,64.53 12.38,63.5 Q3.D
MB1+
  Top 0.508: 66.68,39.05 C12.2 66.75,39.05 68.26,39.05 68.9,39.69 68.9,42.23 69.85,43.18 72.39,43.18 73.66,44.45 73.66,58.74 73.03,59.37 73.03,61.91 86.68,74.93 D4.C
  Bottom 0.508: C12.2 66.68,35.56 65.41,34.29 IC4.OUT | B.1 71.83,87.63 76.2,87.63 81.28,82.55 C10.+ 81.28,77.79 84.14,74.93 D4.C
MB1-  (via drill 0.7)  (1 unrouted)
  Bottom 0.508: B.2 69.93,85.72 74.93,85.72 78.1,82.55 78.1,81.28 | 78.1,81.28 77.79,81.6 C10.- | 78.1,81.28 78.1,76.28 D4.A 76.84,74.86 76.84,72.71 73.34,69.22 v72.71,68.26 | v64.45,48.26 Q4.D
MB2+  (via drill 0.7)  (1 unrouted)
  Top 0.508: v74.29,91.44 v74.29,83.82 74.61,82.87 74.61,79.06 76.52,77.15 77.47,77.15 80.65,73.98 D5.C
  Bottom 0.508: C15.2 66.68,23.5 65.41,22.23 IC5.OUT 65.09,22.15 65.09,20.64 65.72,20 v69.22,20 | B.3 67.31,93.34 73.03,93.34 v74.29,91.44 | v74.29,83.82 71.75,83.19 71.12,82.55 C13.+
MB2-  (via drill 0.7)  (1 unrouted)
  Top 0.508: D5.A 70.49,75.25 v72.39,77.15
  Bottom 0.508: B.4 64.77,86.36 67.31,83.82 67.31,82.16 C13.- 72.31,77.15 v72.39,77.15 | D5.A 68.34,71.68 v68.26,71.75 | v56.83,49.53 Q5.D
MB3+  (via drill 0.7)
  Top 0.508: v50.16,92.71 50.16,90.81 55.24,85.72 62.23,85.72 v63.5,84.45 | D6.C 73.66,72.39 70.49,68.58 70.49,59.05 66.04,55.24 66.04,45.4 63.82,43.18 57.15,43.18 55.88,41.91 55.88,39.69 55.24,39.05 51.51,39.05 C18.2
  Bottom 0.508: C18.2 51.43,35.56 50.16,34.29 IC6.OUT | B.5 63.5,92.71 62.87,93.34 50.8,93.34 v50.16,92.71 | v63.5,84.45 62.23,83.19 C16.+ 65.97,76.2 66.04,76.2 67.38,74.86 D6.C
MB3-  (via drill 0.7)
  Top 0.508: v49.53,50.8 49.53,56.2 v47.62,58.1 | v60.32,68.9 61.91,68.9 63.5,70.48 D6.A
  Bottom 0.508: B.6 60.96,87.07 60.96,83.82 58.74,81.6 C16.- 58.74,79.62 D6.A | v49.53,50.8 Q6.D | v47.62,58.1 47.62,67.63 48.9,68.9 v60.32,68.9
MB4+  (via drill 0.7)
  Top 0.508: v50.8,86.36 52.07,85.09 53.98,85.09 v55.88,83.82 | v54.29,42.55 58.42,46.67 58.42,53.66 63.5,58.74 67.94,58.74 69.22,60.01 69.22,66.99 66.04,70.17 D7.C | v54.29,36.83 54.29,28.33 C21.2
  Bottom 0.508: 49.85,21.59 IC7.OUT 51.43,23.81 C21.2 | B.7 52.15,90.88 50.16,88.9 50.16,87 v50.8,86.36 | D7.C 61.04,71.68 55.88,76.83 53.66,76.83 53.34,77.15 C19.+ 55.88,83.11 v55.88,83.82 | v54.29,42.55 v54.29,36.83
MB4-  (via drill 0.7)  (1 unrouted)
  Bottom 0.508: B.8 59.69,87.63 58.42,86.36 55.64,86.36 C19.- 49.85,77.47 52.71,74.61 | D7.A 55.64,71.68 52.71,74.61 | v52.71,71.75 52.71,74.61 | v41.91,50.8 Q7.D
N$1
  Bottom 0.406: R1.P$2 40.39,59.44 38.1,57.15 33.02,57.15 Q1.G
N$2
  Bottom 0.508: XOUT.2 3.81,91.12 10.79,91.12 R15.P$2
N$3
  Bottom 0.406: R2.P$2 37.85,59.44 36.83,58.42 25.4,58.42 Q2.G
N$4
  Bottom 0.406: R9.P$2 59.69,58.74 61.6,56.83 80.96,56.83 83.19,54.61 Q9.B
N$5
  Bottom 0.406: R10.P$2 57.15,58.42 60.01,55.56 73.03,55.56 75.25,53.34 Q10.B
N$9
  Bottom 0.406: R8.P$2 63.82,60.33 66.04,58.1 89.22,58.1 Q8.B
N$14  (via drill 0.7)
  Top 0.508: v17.46,53.34 17.46,52.39 16.19,51.12 12.06,51.12 7.62,54.29 7.62,63.5 10.16,66.04 v13.97,66.04
  Bottom 0.508: v13.97,66.04 Q3.G | R3.P$2 21.27,60.33 20.64,59.69 20.64,57.47 20.32,57.15 18.1,57.15 17.46,56.52 v17.46,53.34
N$15
  pour Top (isolate 0.813): 5.08,13.34 49.53,13.34 49.53,6.35 5.08,6.35
N$16
  Bottom 0.406: R4.P$2 52.07,58.1 59.37,50.8 Q4.G
N$18
  Bottom 0.406: R5.P$2 50.48,59.37 50.48,53.34 51.75,52.07 Q5.G
N$19
  Bottom 0.406: R6.P$2 45.47,53.59 Q6.G
N$20
  Bottom 0.406: R7.P$2 42.93,58.17 Q7.G
N$21
  Bottom 0.406: R11.P$2 54.61,58.42 59.05,53.98 66.36,53.98 68.26,52.07 Q11.B
N$25
  Bottom 0.508: OK1.3 128.27,33.34 132.4,29.21 D13.A 146.37,42.23 150.5,42.23 XIN.3
N$26
  Top 0.508: D13.C R12.P$1
  Bottom 0.508: D13.C OK1.2
N$27
  Bottom 0.508: R12.P$2 144.78,37.47 150.5,37.47 XIN.2
N$29
  Bottom 0.508: R14.P$1 OK1.7
P2
  Top 0.406: B1.2 R8.P$1
P3
  Top 0.406: B1.3 R9.P$1
P4
  Top 0.406: B1.4 R10.P$1
P5
  Top 0.406: B1.5 R11.P$1
P6
  Top 0.406: B1.6 R4.P$1
P7
  Top 0.406: B1.7 R5.P$1
P8
  Top 0.406: B1.8 R6.P$1
P9
  Top 0.406: B1.9 R7.P$1
P10
  Top 0.406: B1.10 R1.P$1
P11
  Top 0.406: B1.11 R2.P$1
P12
  Top 0.406: B1.12 R3.P$1
PRX
  Top 0.406: B1.0 R13.P$2
  Bottom 0.406: OK1.6 126.68,40.32 114.62,40.32 94.62,60.33 80.65,60.33 76.2,63.5 71.12,63.5 69.29,61.67 R13.P$2
PTX  (via drill 0.7)
  Top 0.406: v15.88,78.42 32.07,67.31 62.87,67.31 B1.1
  Bottom 0.406: v15.88,78.42 12.38,85.72 3.81,85.72 XOUT.3

### Text on the board
Top: PHOBOS EnsembleFour v1.1h
tSilk: MECANO | DOGS | SPRING∆ | NULL